# Altium project Design_Project.PrjPCB
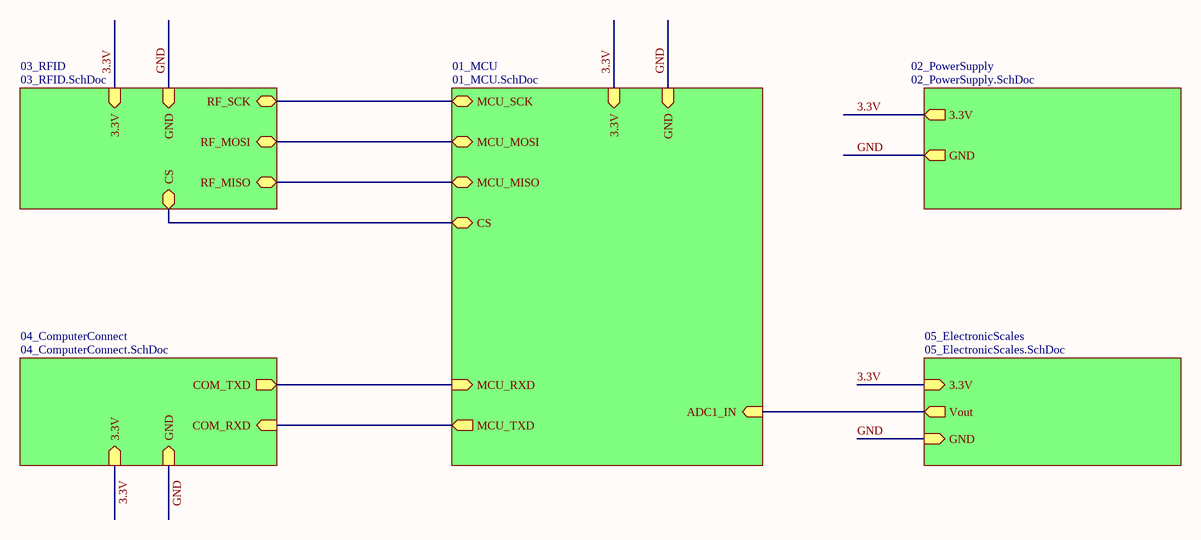
[diagram p0: SheetConnection.SchDoc]
6 sheets, 27 parts. Net scope: hierarchical (ports join the sheet entries above them; power ports are global).
Board files: Design_Project.PcbDoc, Logo.pcbdoc
Sheets:
  SheetConnection.SchDoc
    01_MCU = 01_MCU.SchDoc
    05_ElectronicScales = 05_ElectronicScales.SchDoc
    03_RFID = 03_RFID.SchDoc
    04_ComputerConnect = 04_ComputerConnect.SchDoc
    02_PowerSupply = 02_PowerSupply.SchDoc

## Sheet SheetConnection.SchDoc
size A4

### Sub-sheets
01_MCU = 01_MCU.SchDoc: MCU_TXD (out), MCU_RXD (in), MCU_SCK (bidir), MCU_MOSI (bidir), MCU_MISO (bidir), ADC1_IN (in), GND (in), 3.3V (in), CS (bidir)
02_PowerSupply = 02_PowerSupply.SchDoc: 3.3V (out), GND (out)
03_RFID = 03_RFID.SchDoc: RF_SCK (bidir), RF_MOSI (bidir), RF_MISO (bidir), GND (in), 3.3V (in), CS (bidir)
04_ComputerConnect = 04_ComputerConnect.SchDoc: COM_TXD (out), COM_RXD (in), GND (in), 3.3V (in)
05_ElectronicScales = 05_ElectronicScales.SchDoc: 3.3V (in), Vout (out), GND (in)

### Nets
3.3V: sheet 01_MCU/3.3V, sheet 05_ElectronicScales/3.3V, sheet 03_RFID/3.3V, sheet 04_ComputerConnect/3.3V, sheet 02_PowerSupply/3.3V
GND: sheet 01_MCU/GND, sheet 05_ElectronicScales/GND, sheet 03_RFID/GND, sheet 04_ComputerConnect/GND, sheet 02_PowerSupply/GND
NetC7_1: sheet 01_MCU/CS, sheet 03_RFID/CS
NetC7_2: sheet 01_MCU/MCU_SCK, sheet 03_RFID/RF_SCK
NetC7_3: sheet 01_MCU/MCU_MOSI, sheet 03_RFID/RF_MOSI
NetC7_4: sheet 01_MCU/MCU_MISO, sheet 03_RFID/RF_MISO
NetP1_3: sheet 01_MCU/MCU_RXD, sheet 04_ComputerConnect/COM_TXD
NetP1_4: sheet 01_MCU/MCU_TXD, sheet 04_ComputerConnect/COM_RXD
NetU1_36: sheet 01_MCU/ADC1_IN, sheet 05_ElectronicScales/Vout

### Notes on the sheet
- Project:
- MANDevices
- Page Contents:
- Size:
- Date:
- A4
- Checked by:
- Time:
- Revision:
- Sheet
- of
- HaNoi University of
- Science and Technology
- File:

## Sheet 01_MCU.SchDoc
size A4
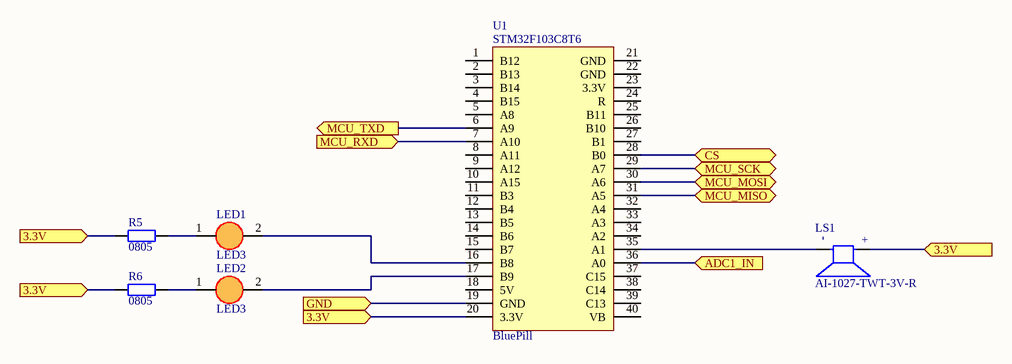
[diagram p1: 01_MCU.SchDoc]

### Parts
LED1  LED3  [LED3mm]
LED2  LED3  [LED3mm]
LS1  AI-1027-TWT-3V-R  [XDCR_AI-1027-TWT-3V-R]
R5  value 0805  [DIEN TRO 0805]  (hidden comment: R0805)
R6  value 0805  [DIEN TRO 0805]  (hidden comment: R0805)
U1  BluePill  [DIP40 - duplicate]

### Ports
3.3V (in), ADC1_IN (in), CS (bidir), GND (in), MCU_MISO (bidir), MCU_MOSI (bidir), MCU_RXD (in), MCU_SCK (bidir), MCU_TXD (out)

### Nets
3.3V: LS1.P R5.1 R6.1 U1.20(3.3V) ; port 3.3V
GND: U1.19(GND) ; port GND
NetC7_1: U1.28(B0) ; port CS
NetC7_2: U1.29(A7) ; port MCU_SCK
NetC7_3: U1.30(A6) ; port MCU_MOSI
NetC7_4: U1.31(A5) ; port MCU_MISO
NetLED1_1: LED1.1(A) R5.2
NetLED1_2: LED1.2(K) U1.16(B8)
NetLED2_1: LED2.1(A) R6.2
NetLED2_2: LED2.2(K) U1.17(B9)
NetLS1_N: LS1.N U1.35(A1)
NetP1_3: U1.7(A10) ; port MCU_RXD
NetP1_4: U1.6(A9) ; port MCU_TXD
NetU1_36: U1.36(A0) ; port ADC1_IN

Not connected (* = marked no-connect by the designer): U1 1(B12) 2(B13) 3(B14) 4(B15) 5(A8) 8(A11) 9(A12) 10(A15) 11(B3) 12(B4) 13(B5) 14(B6) 15(B7) 18(5V) 21(GND) 22(GND) 23(3.3V) 24(R) 25(B11) 26(B10) 27(B1) 32(A4) 33(A3) 34(A2) 37(C15) 38(C14) 39(C13) 40(VB)

### Notes on the sheet
- Project:
- MANDevices
- Page Contents:
- Size:
- Date:
- A4
- Checked by:
- Time:
- Revision:
- Sheet
- of
- HaNoi University of
- Science and Technology
- File:
- (in symbol AI-1027-TWT-3V-R) -; +
- (in symbol BluePill) STM32F103C8T6

### Library data of the parts
LED1 LED2 = LED 3mm
LS1 = AI-1027-TWT-3V-R: Buzzers Indicator, Internally Driven Electromechanical/Magnetic 3V 30mA 2.7kHz 80dB @ 3V, 10cm Through Hole PC Pins; MF: PUI Audio, Inc.; Price: None; SnapEDA_Link: https://www.snapeda.com/parts/AI-1027-TWT-3V-R/PUI%20Audio,%20Inc./view-part/7376009/?ref=snap; Purchase-URL: https://pricing.snapeda.com/search/part/AI-1027-TWT-3V-R/?ref=eda; Check_prices: https://www.snapeda.com/parts/AI-1027-TWT-3V-R/PUI%20Audio,%20Inc./view-part/7376009/?ref=eda; Value: *; MP: AI-1027-TWT-3V-R; Package: None; Availability: In Stock
R5 R6 = R0805: Resistor SMD 0805; Published: 8-Jun-2000; LatestRevisionDate: 17-Jul-2002; LatestRevisionNote: Re-released for DXP Platform.; PackageReference: AXIAL-0.4; Publisher: Altium Limited

## Sheet 05_ElectronicScales.SchDoc
size A4
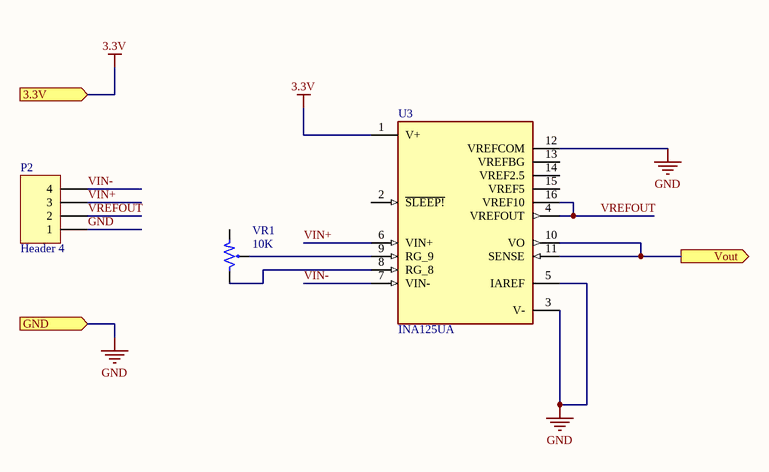
[diagram p2: 05_ElectronicScales.SchDoc]

### Parts
P2  Header 4  [HDR1X4]
U3  INA125UA  [SOIC127P600X175-16N]
VR1  10K  [VR]

### Ports
3.3V (in), GND (in), Vout (out)

### Nets
3.3V: U3.1(V+) ; port 3.3V
GND: P2.1 U3.3(V-) U3.5(IAREF) U3.12(VREFCOM) ; port GND
VIN+: P2.3 U3.6(VIN+)
VIN-: P2.4 U3.7(VIN-)
VREFOUT: P2.2 U3.4(VREFOUT) U3.16(VREF10)
NetU1_36: U3.10(VO) U3.11(SENSE) ; port Vout
NetU3_8: U3.8(RG_8) VR1.3
NetU3_9: U3.9(RG_9) VR1.2

Not connected (* = marked no-connect by the designer): U3 2(~{SLEEP!}) 13(VREFBG) 14(VREF2.5) 15(VREF5); VR1 1

### Notes on the sheet
- Project:
- MANDevices
- Page Contents:
- Size:
- Date:
- A4
- Checked by:
- Time:
- Revision:
- Sheet
- of
- HaNoi University of
- Science and Technology
- File:

### Library data of the parts
P2 = Header 4: Header, 4-Pin; LatestRevisionDate: 17-Jul-2002; LatestRevisionNote: Re-released for DXP Platform.; Publisher: Altium Limited
U3 = INA125UA: Instrumentation Amplifier with Precision Voltage Reference 16-SOIC; Price: None; MP: INA125UA; Value: *; Availability: Unavailable; Package: None
VR1 = VR1: Var Resistor; Value: VR 10K

## Sheet 03_RFID.SchDoc
size A4
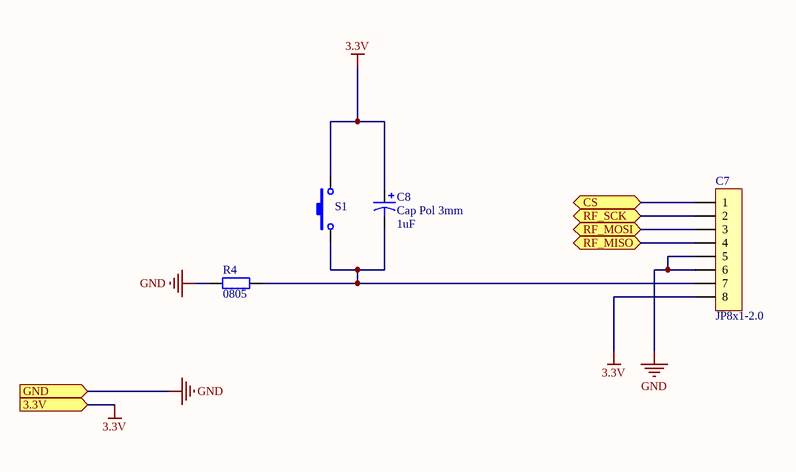
[diagram p3: 03_RFID.SchDoc]

### Parts
C7  JP8x1-2.0  [J8-C1T]
C8  Cap Pol 3mm  [C3MM]
R4  value 0805  [DIEN TRO 0805]  (hidden comment: R0805)
S1  SW-SMD  [SW-SMD]  (value not drawn)

### Ports
3.3V (in), CS (bidir), GND (in), RF_MISO (bidir), RF_MOSI (bidir), RF_SCK (bidir)

### Nets
3.3V: C7.8 C8.1 S1.2 ; port 3.3V
GND: C7.5 C7.6 R4.1 ; port GND
NetC7_1: C7.1 ; port CS
NetC7_2: C7.2 ; port RF_SCK
NetC7_3: C7.3 ; port RF_MOSI
NetC7_4: C7.4 ; port RF_MISO
NetC7_7: C7.7 C8.2 R4.2 S1.1

### Notes on the sheet
- Project:
- MANDevices
- Page Contents:
- Size:
- Date:
- A4
- Checked by:
- Time:
- Revision:
- Sheet
- of
- HaNoi University of
- Science and Technology
- File:
- (in symbol Cap Pol 3mm) 1uF

### Library data of the parts
C7 = JP8x1-2.0: WR-PHD 2.00 mm Socket Header; Manufacturer: W¨¹rth Elektronik eiSos GmbH; partNo: 62000811821; ComponentLink1 Description: Manufacturer; ComponentLink2 Description: Datasheet; NoPins: 08; Created Date: 2 April 2013; ComponentLink1URL: http://www.we-online.com; ComponentLink2URL: http://katalog.we-online.de/em/datasheet/6200xx11821.pdf; Created by: Karrer Zheng
C8 = Cap Pol 3mm: Polarized Capacitor (Axial); Published: 8-Jun-2000; LatestRevisionDate: 17-Jul-2002; LatestRevisionNote: Re-released for DXP Platform.; PackageReference: POLAR0.8; Publisher: Altium Limited
R4 = R0805: Resistor SMD 0805; Published: 8-Jun-2000; LatestRevisionDate: 17-Jul-2002; LatestRevisionNote: Re-released for DXP Platform.; PackageReference: AXIAL-0.4; Publisher: Altium Limited
S1 = SW-SMD: Switch; Published: 24-Mar-1999; LatestRevisionDate: 17-Jul-2002; LatestRevisionNote: Re-released for DXP Platform.; PackageReference: SPST-2; Publisher: Altium Limited

## Sheet 04_ComputerConnect.SchDoc
size A4
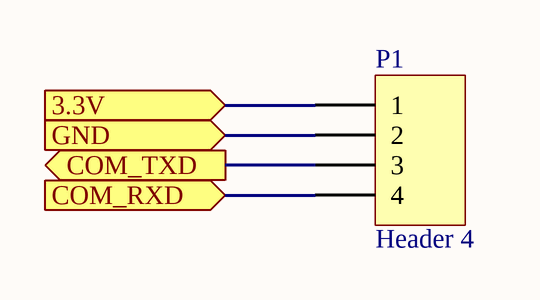
[diagram p4: 04_ComputerConnect.SchDoc]

### Parts
P1  Header 4  [HDR1X4]

### Ports
3.3V (in), COM_RXD (in), COM_TXD (out), GND (in)

### Nets
3.3V: P1.1 ; port 3.3V
GND: P1.2 ; port GND
NetP1_3: P1.3 ; port COM_TXD
NetP1_4: P1.4 ; port COM_RXD

### Notes on the sheet
- Project:
- MANDevices
- Page Contents:
- Size:
- Date:
- A4
- Checked by:
- Time:
- Revision:
- Sheet
- of
- HaNoi University of
- Science and Technology
- File:

### Library data of the parts
P1 = Header 4: Header, 4-Pin; LatestRevisionDate: 17-Jul-2002; LatestRevisionNote: Re-released for DXP Platform.; Publisher: Altium Limited

## Sheet 02_PowerSupply.SchDoc
size A4
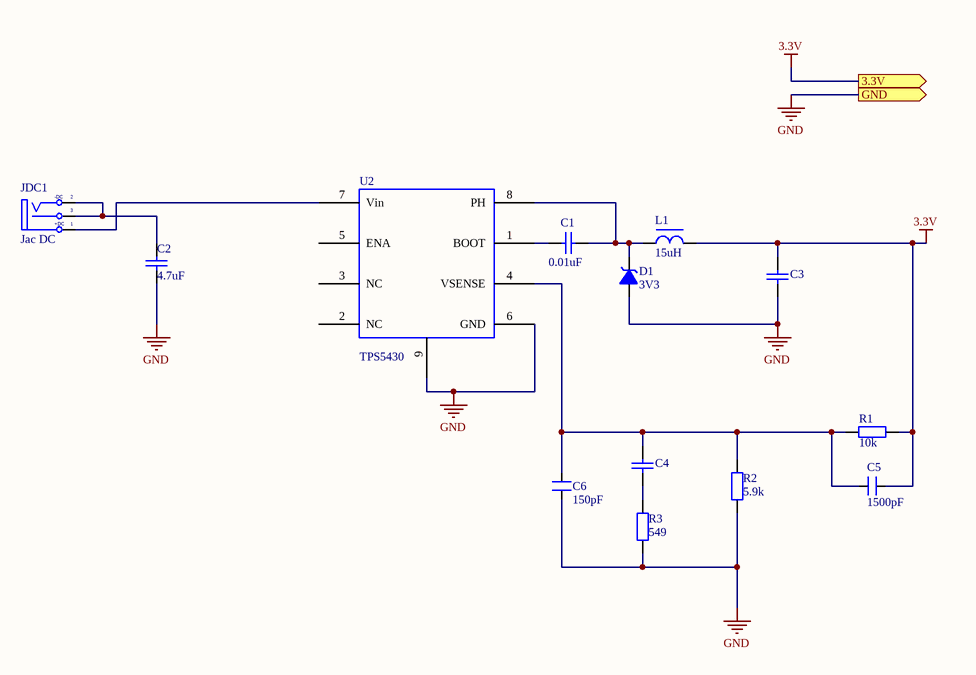
[diagram p5: 02_PowerSupply.SchDoc]

### Parts
C1  0.01uF  [C0805]
C2  4.7uF  [C0805]
C3  Capacitor Ceramic  [C0805]  (value not drawn)
C4  Capacitor Ceramic  [C0805]  (value not drawn)
C5  1500pF  [CN1]
C6  150pF  [CN1]
D1  3V3  [DZ0.5A]
JDC1  Jac DC  [DC-IN]
L1  15uH  [L-DIP-M-5.3]
R1  value 10k  [DIEN TRO 0805]  (hidden comment: R0805)
R2  5.9k  [DIEN TRO 0805]
R3  value 549  [DIEN TRO 0805]  (hidden comment: R0805)
U2  TPS5430  [TPS5430-2]

### Ports
3.3V (out), GND (out)

### Nets
3.3V: C3.2 C5.2 L1.2 R1.2 ; port 3.3V
GND: C2.1 C3.1 C6.1 D1.1(A) R2.1 R3.1 U2.6(GND) U2.9(PWR_PAD) ; port GND
NetC1_1: C1.1 D1.2(K) L1.1 U2.8(PH)
NetC1_2: C1.2 U2.1(BOOT)
NetC2_2: C2.2 JDC1.2(TN) JDC1.3(S)
NetC4_1: C4.1 R3.2
NetC4_2: C4.2 C5.1 C6.2 R1.1 R2.2 U2.4(VSENSE)
NetJDC1_1: JDC1.1(T) U2.7(Vin)

Not connected (* = marked no-connect by the designer): U2 2(NC) 3(NC) 5(ENA)

### Notes on the sheet
- Project:
- MANDevices
- Page Contents:
- Size:
- Date:
- A4
- Checked by:
- Time:
- Revision:
- Sheet
- of
- HaNoi University of
- Science and Technology
- File:
- (in symbol DCIN) -DC; +DC

### Library data of the parts
C1-C4 = CapSMD: Capacitor; Value: 33p; Published: 8-Jun-2000; LatestRevisionDate: 17-Jul-2002; LatestRevisionNote: Re-released for DXP Platform.; PackageReference: RAD-0.3; Publisher: Altium Limited
C5 C6 = CN1: Cap np  1pF - 472pF; Value: 100pF
D1 = DZ: Diode Zenner; Value: 3v3
JDC1 = DCIN: Jac DC input; Value: Jac DC
L1 = L-DIP-1: Inductor; Value: 150 mH
R1-R3 = R0805: Resistor SMD 0805; Published: 8-Jun-2000; LatestRevisionDate: 17-Jul-2002; LatestRevisionNote: Re-released for DXP Platform.; PackageReference: AXIAL-0.4; Publisher: Altium Limited
  R2: Value: 5.9k
U2 = TPS5430: Name: TPS5430

## Nets that join several sheets
3.3V: 01_MCU (LS1.P R5.1 R6.1 U1.20), 05_ElectronicScales (U3.1), 03_RFID (C7.8 C8.1 S1.2), 04_ComputerConnect (P1.1), 02_PowerSupply (C3.2 C5.2 L1.2 R1.2)
GND: 01_MCU (U1.19), 05_ElectronicScales (P2.1 U3.3 U3.5 U3.12), 03_RFID (C7.5 C7.6 R4.1), 04_ComputerConnect (P1.2), 02_PowerSupply (8 pins)
NetC7_1: 01_MCU (U1.28), 03_RFID (C7.1)
NetC7_2: 01_MCU (U1.29), 03_RFID (C7.2)
NetC7_3: 01_MCU (U1.30), 03_RFID (C7.3)
NetC7_4: 01_MCU (U1.31), 03_RFID (C7.4)
NetP1_3: 01_MCU (U1.7), 04_ComputerConnect (P1.3)
NetP1_4: 01_MCU (U1.6), 04_ComputerConnect (P1.4)
NetU1_36: 01_MCU (U1.36), 05_ElectronicScales (U3.10 U3.11)